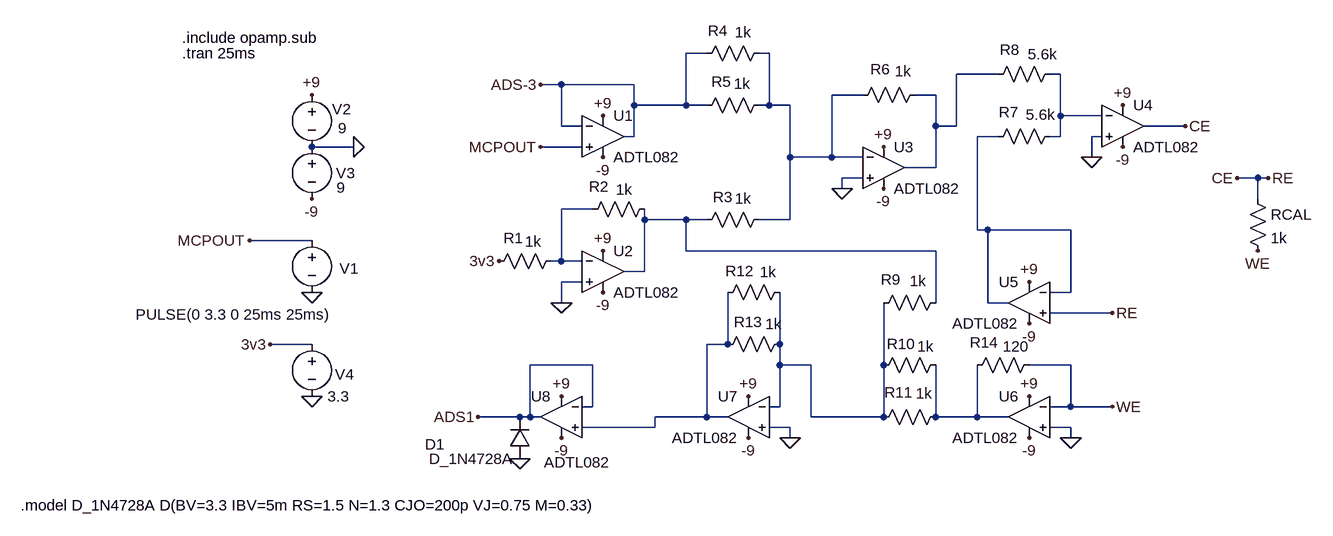
[diagram p0: schematic Simulação.asc]
Simulação.asc, the LTspice schematic file:
Version 4.1
SHEET 1 1020 768
WIRE -48 -96 -80 -96
WIRE 48 -96 32 -96
WIRE 400 -64 336 -64
WIRE 496 -64 480 -64
WIRE -272 -48 -304 -48
WIRE -160 -48 -272 -48
WIRE 192 -32 144 -32
WIRE 304 -32 272 -32
WIRE -160 -16 -160 -48
WIRE -80 -16 -80 -96
WIRE -80 -16 -160 -16
WIRE -48 -16 -80 -16
WIRE 48 -16 48 -96
WIRE 48 -16 32 -16
WIRE 80 -16 48 -16
WIRE 496 0 496 -64
WIRE 560 0 496 0
WIRE -272 16 -272 -48
WIRE -240 16 -272 16
WIRE 304 16 304 -32
WIRE 336 16 336 -64
WIRE 336 16 304 16
WIRE 688 16 624 16
WIRE -160 32 -160 -16
WIRE -160 32 -176 32
WIRE 400 32 368 32
WIRE 496 32 496 0
WIRE 496 32 480 32
WIRE 560 32 544 32
WIRE -592 48 -656 48
WIRE -240 48 -304 48
WIRE 80 64 80 -16
WIRE 144 64 144 -32
WIRE 144 64 80 64
WIRE 192 64 144 64
WIRE 544 64 544 32
WIRE 304 80 304 16
WIRE 304 80 256 80
WIRE 192 96 160 96
WIRE 800 96 768 96
WIRE 816 96 800 96
WIRE 160 112 160 96
WIRE 800 128 800 96
WIRE -224 144 -272 144
WIRE -144 160 -144 144
WIRE -80 160 -144 160
WIRE -48 160 -80 160
WIRE 80 160 80 64
WIRE 80 160 32 160
WIRE 368 176 368 32
WIRE 384 176 368 176
WIRE 512 176 384 176
WIRE -656 192 -752 192
WIRE -80 208 -80 160
WIRE 304 208 -80 208
WIRE -272 224 -272 144
WIRE -272 224 -288 224
WIRE -240 224 -272 224
WIRE -144 240 -144 160
WIRE -144 240 -176 240
WIRE -240 256 -272 256
WIRE 512 272 512 176
WIRE 512 272 480 272
WIRE -272 288 -272 256
WIRE 304 288 304 208
WIRE 384 288 384 176
WIRE 416 288 384 288
WIRE 576 304 480 304
WIRE -656 352 -720 352
WIRE -16 352 -16 272
WIRE -16 352 -48 352
WIRE 64 352 64 272
WIRE -224 384 -320 384
WIRE 64 384 64 352
WIRE 112 384 64 384
WIRE 224 384 224 288
WIRE 512 384 448 384
WIRE -224 448 -224 384
WIRE -224 448 -240 448
WIRE 64 448 64 384
WIRE 64 448 48 448
WIRE 512 448 512 384
WIRE 512 448 480 448
WIRE 576 448 512 448
WIRE -336 464 -400 464
WIRE -320 464 -320 384
WIRE -320 464 -336 464
WIRE -304 464 -320 464
WIRE -48 464 -48 352
WIRE -48 464 -128 464
WIRE -16 464 -48 464
WIRE 112 464 112 384
WIRE 224 464 224 384
WIRE 224 464 112 464
WIRE 304 464 304 384
WIRE 368 464 368 384
WIRE 368 464 304 464
WIRE 416 464 368 464
WIRE -128 480 -128 464
WIRE -128 480 -240 480
WIRE 80 480 48 480
WIRE 512 480 480 480
WIRE 80 496 80 480
WIRE 512 496 512 480
FLAG -304 48 MCPOUT
FLAG -304 -48 ADS-3
FLAG -592 48 0
FLAG -656 -32 +9
FLAG -208 0 +9
FLAG -208 64 -9
FLAG -656 128 -9
FLAG -656 272 0
FLAG -752 192 MCPOUT
FLAG -656 432 0
FLAG -720 352 3v3
FLAG -208 208 +9
FLAG -208 272 -9
FLAG -272 288 0
FLAG -368 224 3v3
FLAG 160 112 0
FLAG 224 112 -9
FLAG 224 48 +9
FLAG 688 16 CE
FLAG 576 304 RE
FLAG 592 -16 +9
FLAG 448 256 +9
FLAG 592 48 -9
FLAG 448 320 -9
FLAG 544 64 0
FLAG 800 208 WE
FLAG 768 96 CE
FLAG 816 96 RE
FLAG 448 432 +9
FLAG 16 432 +9
FLAG -272 432 +9
FLAG 448 496 -9
FLAG 16 496 -9
FLAG -272 496 -9
FLAG -400 464 ADS1
FLAG 80 496 0
FLAG 512 496 0
FLAG 576 448 WE
FLAG -336 528 0
SYMBOL voltage -656 176 R0
WINDOW 3 -271 130 Left 2
WINDOW 123 0 0 Left 0
WINDOW 39 0 0 Left 0
WINDOW 0 43 59 Left 2
SYMATTR Value PULSE(0 3.3 0 25ms 25ms)
SYMATTR InstName V1
SYMBOL voltage -656 -48 R0
WINDOW 123 0 0 Left 0
WINDOW 39 0 0 Left 0
WINDOW 0 31 38 Left 2
WINDOW 3 40 67 Left 2
SYMATTR InstName V2
SYMATTR Value 9
SYMBOL voltage -656 32 R0
WINDOW 123 0 0 Left 0
WINDOW 39 0 0 Left 0
WINDOW 0 37 56 Left 2
WINDOW 3 38 79 Left 2
SYMATTR InstName V3
SYMATTR Value 9
SYMBOL OpAmps\\ADTL082 -208 -32 R0
SYMATTR InstName U1
SYMBOL voltage -656 336 R0
WINDOW 123 0 0 Left 0
WINDOW 39 0 0 Left 0
WINDOW 0 36 62 Left 2
SYMATTR InstName V4
SYMATTR Value 3.3
SYMBOL OpAmps\\ADTL082 -208 176 R0
SYMATTR InstName U2
SYMBOL res -128 128 R90
WINDOW 0 -3 86 VBottom 2
WINDOW 3 -30 47 VTop 2
SYMATTR InstName R2
SYMATTR Value 1k
SYMBOL res -272 208 R90
WINDOW 0 -4 74 VBottom 2
WINDOW 3 -30 43 VTop 2
SYMATTR InstName R1
SYMATTR Value 1k
SYMBOL res 48 -32 R90
WINDOW 0 -5 74 VBottom 2
WINDOW 3 -33 42 VTop 2
SYMATTR InstName R5
SYMATTR Value 1k
SYMBOL res 48 144 R90
WINDOW 0 -3 71 VBottom 2
WINDOW 3 -32 40 VTop 2
SYMATTR InstName R3
SYMATTR Value 1k
SYMBOL OpAmps\\ADTL082 224 16 R0
SYMATTR InstName U3
SYMBOL res 288 -48 R90
WINDOW 0 -8 69 VBottom 2
WINDOW 3 -36 34 VTop 2
SYMATTR InstName R6
SYMATTR Value 1k
SYMBOL res 48 -112 R90
WINDOW 0 -3 79 VBottom 2
WINDOW 3 -32 40 VTop 2
SYMATTR InstName R4
SYMATTR Value 1k
SYMBOL res 496 16 R90
WINDOW 0 -6 79 VBottom 2
WINDOW 3 -33 30 VTop 2
SYMATTR InstName R7
SYMATTR Value 5.6k
SYMBOL res 496 -80 R90
WINDOW 0 -6 78 VBottom 2
WINDOW 3 -30 27 VTop 2
SYMATTR InstName R8
SYMATTR Value 5.6k
SYMBOL OpAmps\\ADTL082 592 -48 R0
SYMATTR InstName U4
SYMBOL OpAmps\\ADTL082 448 224 M0
SYMATTR InstName U5
SYMBOL OpAmps\\ADTL082 448 400 M0
SYMATTR InstName U6
SYMBOL OpAmps\\ADTL082 16 400 M0
SYMATTR InstName U7
SYMBOL OpAmps\\ADTL082 -272 400 M0
WINDOW 3 -75 134 Left 2
SYMATTR InstName U8
SYMBOL res 80 336 R90
WINDOW 0 -3 64 VBottom 2
WINDOW 3 -31 25 VTop 2
SYMATTR InstName R13
SYMATTR Value 1k
SYMBOL res 80 256 R90
WINDOW 0 -1 77 VBottom 2
WINDOW 3 -31 34 VTop 2
SYMATTR InstName R12
SYMATTR Value 1k
SYMBOL res 320 448 R90
WINDOW 0 -6 73 VBottom 2
WINDOW 3 -36 34 VTop 2
SYMATTR InstName R11
SYMATTR Value 1k
SYMBOL res 320 368 R90
WINDOW 0 -1 69 VBottom 2
WINDOW 3 -28 31 VTop 2
SYMATTR InstName R10
SYMATTR Value 1k
SYMBOL res 320 272 R90
WINDOW 0 -4 85 VBottom 2
WINDOW 3 -33 43 VTop 2
SYMATTR InstName R9
SYMATTR Value 1k
SYMBOL res 464 368 R90
WINDOW 0 -3 85 VBottom 2
WINDOW 3 -28 36 VTop 2
SYMATTR InstName R14
SYMATTR Value 120
SYMBOL diode -320 528 R180
WINDOW 0 131 22 Left 2
WINDOW 3 24 0 Left 2
SYMATTR InstName D1
SYMATTR Value D_1N4728A
SYMBOL res 784 112 R0
SYMATTR InstName RCAL
SYMATTR Value 1k
TEXT -856 -96 Left 2 !.tran 25ms
TEXT -856 -120 Left 2 !.include opamp.sub
TEXT -1104 600 Left 2 !.model D_1N4728A D(BV=3.3 IBV=5m RS=1.5 N=1.3 CJO=200p VJ=0.75 M=0.33)

The netlist it stands for:
* Simulação.asc
V1 MCPOUT 0 PULSE(0 3.3 0 25ms 25ms)
V2 +9 0 9
V3 0 -9 9
X§U1 MCPOUT ADS-3 +9 -9 ADS-3 ADTL082  ; pins In+ In- V+ V- OUT
V4 3v3 0 3.3
X§U2 0 N005 +9 -9 N006 ADTL082  ; pins In+ In- V+ V- OUT
R2 N006 N005 1k
R1 N005 3v3 1k
R5 N001 ADS-3 1k
R3 N001 N006 1k
X§U3 0 N001 +9 -9 N002 ADTL082  ; pins In+ In- V+ V- OUT
R6 N002 N001 1k
R4 N001 ADS-3 1k
R7 N003 N004 5.6k
R8 N003 N002 5.6k
X§U4 0 N003 +9 -9 RE ADTL082  ; pins In+ In- V+ V- OUT
X§U5 RE N004 +9 -9 N004 ADTL082  ; pins In+ In- V+ V- OUT
X§U6 0 WE +9 -9 N009 ADTL082  ; pins In+ In- V+ V- OUT
X§U7 0 N008 +9 -9 N007 ADTL082  ; pins In+ In- V+ V- OUT
X§U8 N007 ADS1 +9 -9 ADS1 ADTL082  ; pins In+ In- V+ V- OUT
R13 N008 N007 1k
R12 N008 N007 1k
R11 N009 N008 1k
R10 N009 N008 1k
R9 N006 N008 1k
R14 WE N009 120
D1 0 ADS1 D_1N4728A
RCAL RE WE 1k
.model D D
.lib standard.dio
.tran 25ms
.include opamp.sub
.model D_1N4728A D(BV=3.3 IBV=5m RS=1.5 N=1.3 CJO=200p VJ=0.75 M=0.33)
.lib ADI.lib
.backanno
.end